# EAGLE design Christmas_Kit (EAGLE 6.4)
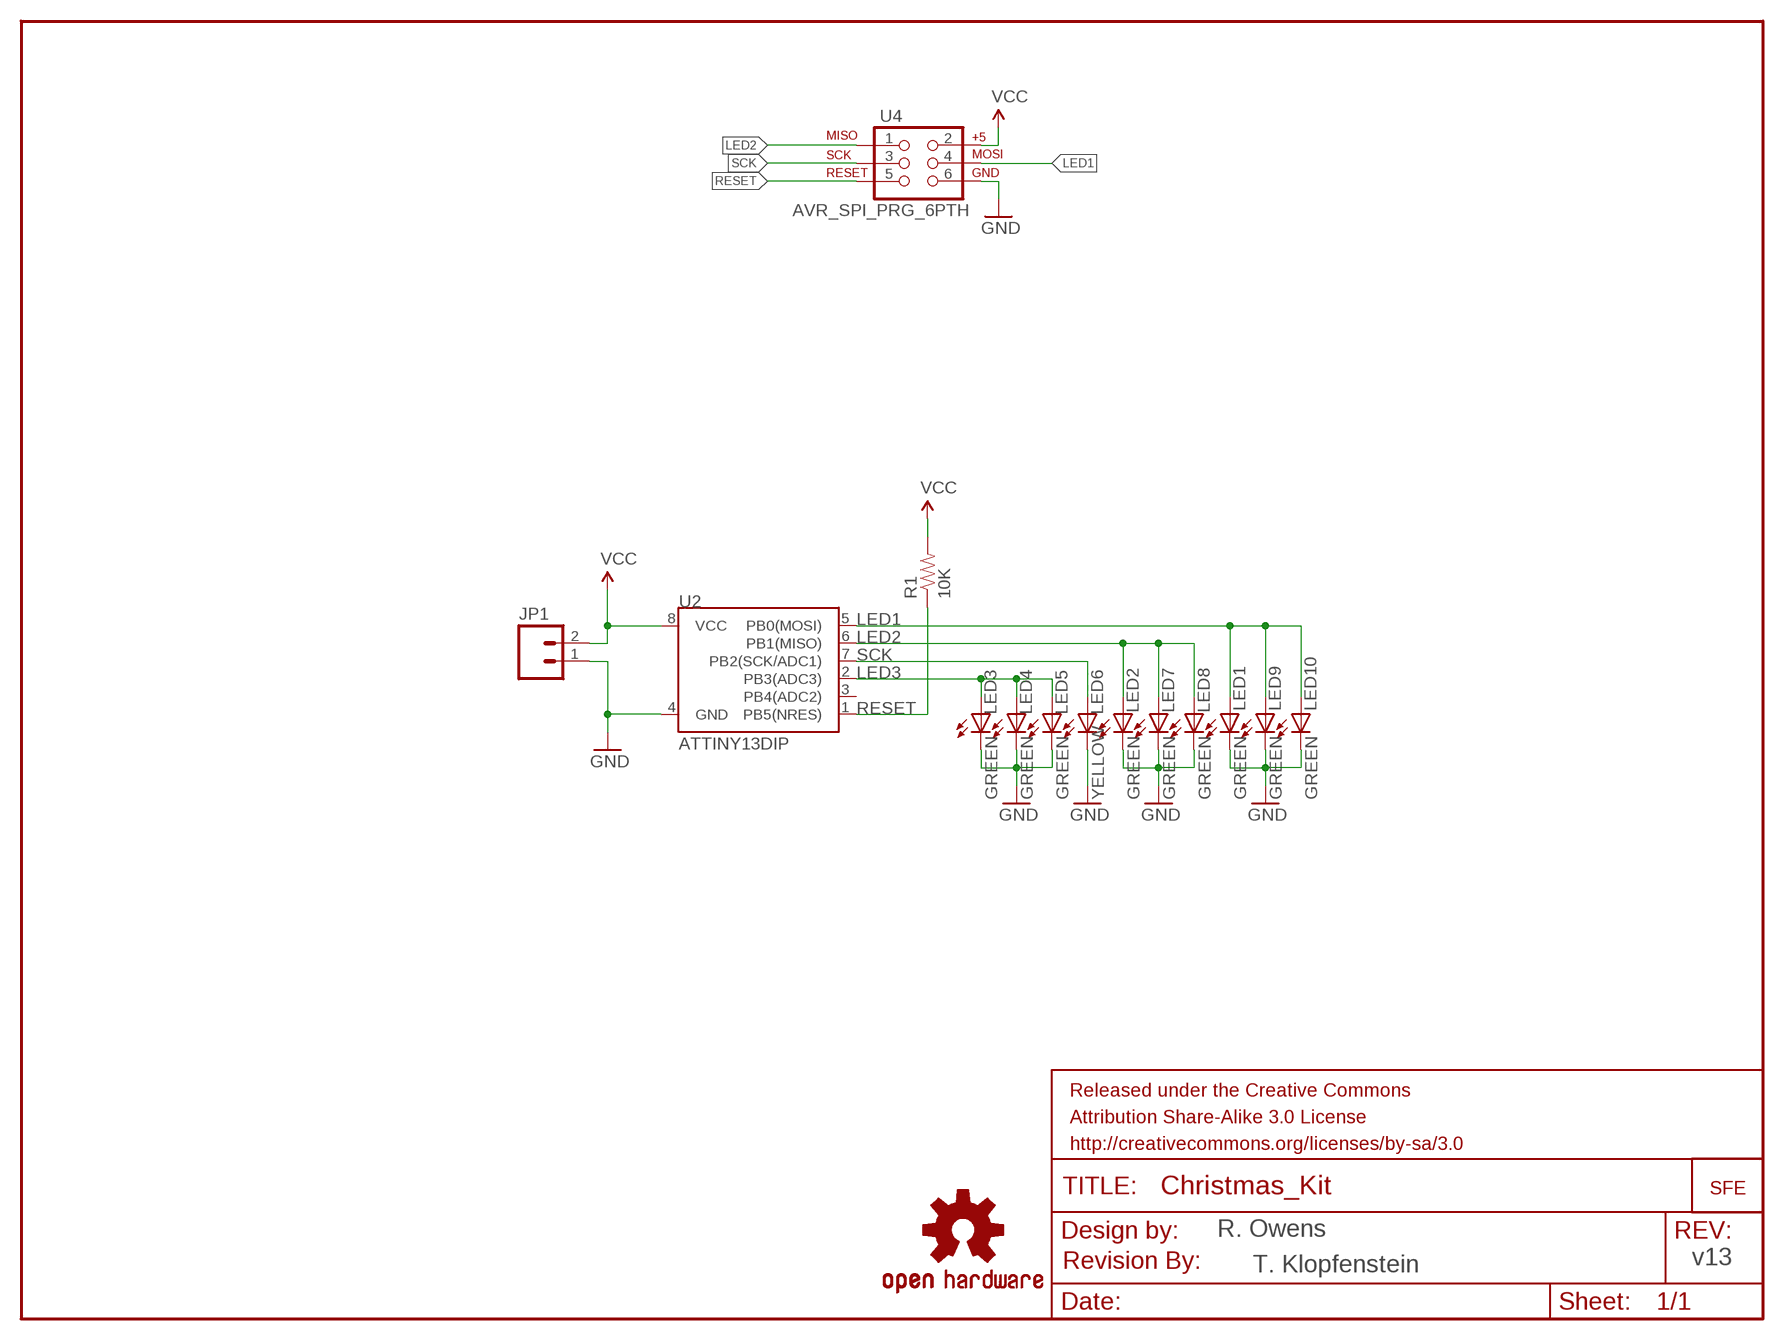
[diagram p0: schematic, sheet 1]

## Parts
FRAME1  FRAME-LETTER  [CREATIVE_COMMONS]
JP1  M02PTH  [1X02]
JP2  LOGO-SFENEW  [SFE-NEW-WEBLOGO]
LED1  GREEN  LED5MM  [LED5MM]
LED2  GREEN  LED5MM  [LED5MM]
LED3  GREEN  LED5MM  [LED5MM]
LED4  GREEN  LED5MM  [LED5MM]
LED5  GREEN  LED5MM  [LED5MM]
LED6  YELLOW  LED3MM  [LED3MM]
LED7  GREEN  LED5MM  [LED5MM]
LED8  GREEN  LED5MM  [LED5MM]
LED9  GREEN  LED5MM  [LED5MM]
LED10  GREEN  LED5MM  [LED5MM]
LOGO1  OSHW-LOGOL  [OSHW-LOGO-L]
R1  10K  RESISTORPTH1  [AXIAL-0.3]
U2  ATTINY13DIP  [DIP08]
U4  AVR_SPI_PRG_6PTH  [2X3]
U$1  REVISION  [REVISION]

## Nets
GND: JP1.1 LED1.K(C) LED2.K(C) LED3.K(C) LED4.K(C) LED5.K(C) LED6.K(C) LED7.K(C) LED8.K(C) LED9.K(C) LED10.K(C) U2.4(GND) U4.6
LED1: LED1.A LED9.A LED10.A U2.5(PB0(MOSI)) U4.4
LED2: LED2.A LED7.A LED8.A U2.6(PB1(MISO)) U4.1
LED3: LED3.A LED4.A LED5.A U2.2(PB3(ADC3))
RESET: R1.P$1 U2.1(PB5(NRES)) U4.5
SCK: LED6.A U2.7(PB2(SCK/ADC1)) U4.3
VCC: JP1.2 R1.P$2 U2.8(VCC) U4.2
Unconnected: U2.3(PB4(ADC2))

## Notes on the sheet
- R. Owens
- v13
- T. Klopfenstein

## Library data of the parts
FRAME1 = SparkFun-Aesthetics:FRAME-LETTER: Schematic Frame Standard 8.5x11 US Letter frame
JP1 = SparkFun:M02: Header 2 Standard 2-pin 0.1" header. Use with straight break away headers (SKU : PRT-00116), right angle break away headers (PRT-00553), swiss pins (PRT-00743), machine pins (PRT-00117), and female headers (PRT-00115). Molex polarized connector foot print use with SKU : PRT-08233 with associated crimp pins and housings.
JP2 = SparkFun:LOGO-SFE: Spark Fun Electronics PCB Logo This is the standard Spark Fun Electronics PCB logo.
LED1-LED10 = SparkFun:LED: LEDs Standard schematic elements and footprints for 5mm, 3mm, 1206, and 0603 sized LEDs. 5mm - Spark Fun Electronics SKU : COM-00529 (and others)
LOGO1 = SparkFun-Aesthetics:OSHW-LOGO: Open Source Hardware Logo This logo indicates the piece of hardware it is found on incorporates a OSHW license and/or adheres to the definition of open source hardware found here: http://freedomdefined.org/OSHW
R1 = SparkFun:RESISTOR: Resistor Basic schematic elements and footprints for 0603, 1206, and PTH 1/10th watt (small) resistors.
U2 = SparkFun:ATTINY13
U4 = SparkFun:AVR_SPI_PRG_6: AVR ISP 6 Pin This is the reduced ISP connector for AVR programming. Common on Arduino. This footprint will take up less PCB space and can be used with a 10-pin to 6-pin adapter such as SKU: BOB-08508
U$1 = SparkFun-Aesthetics:REVISION

## Net classes
0 default: width 0.203 mm

## Board
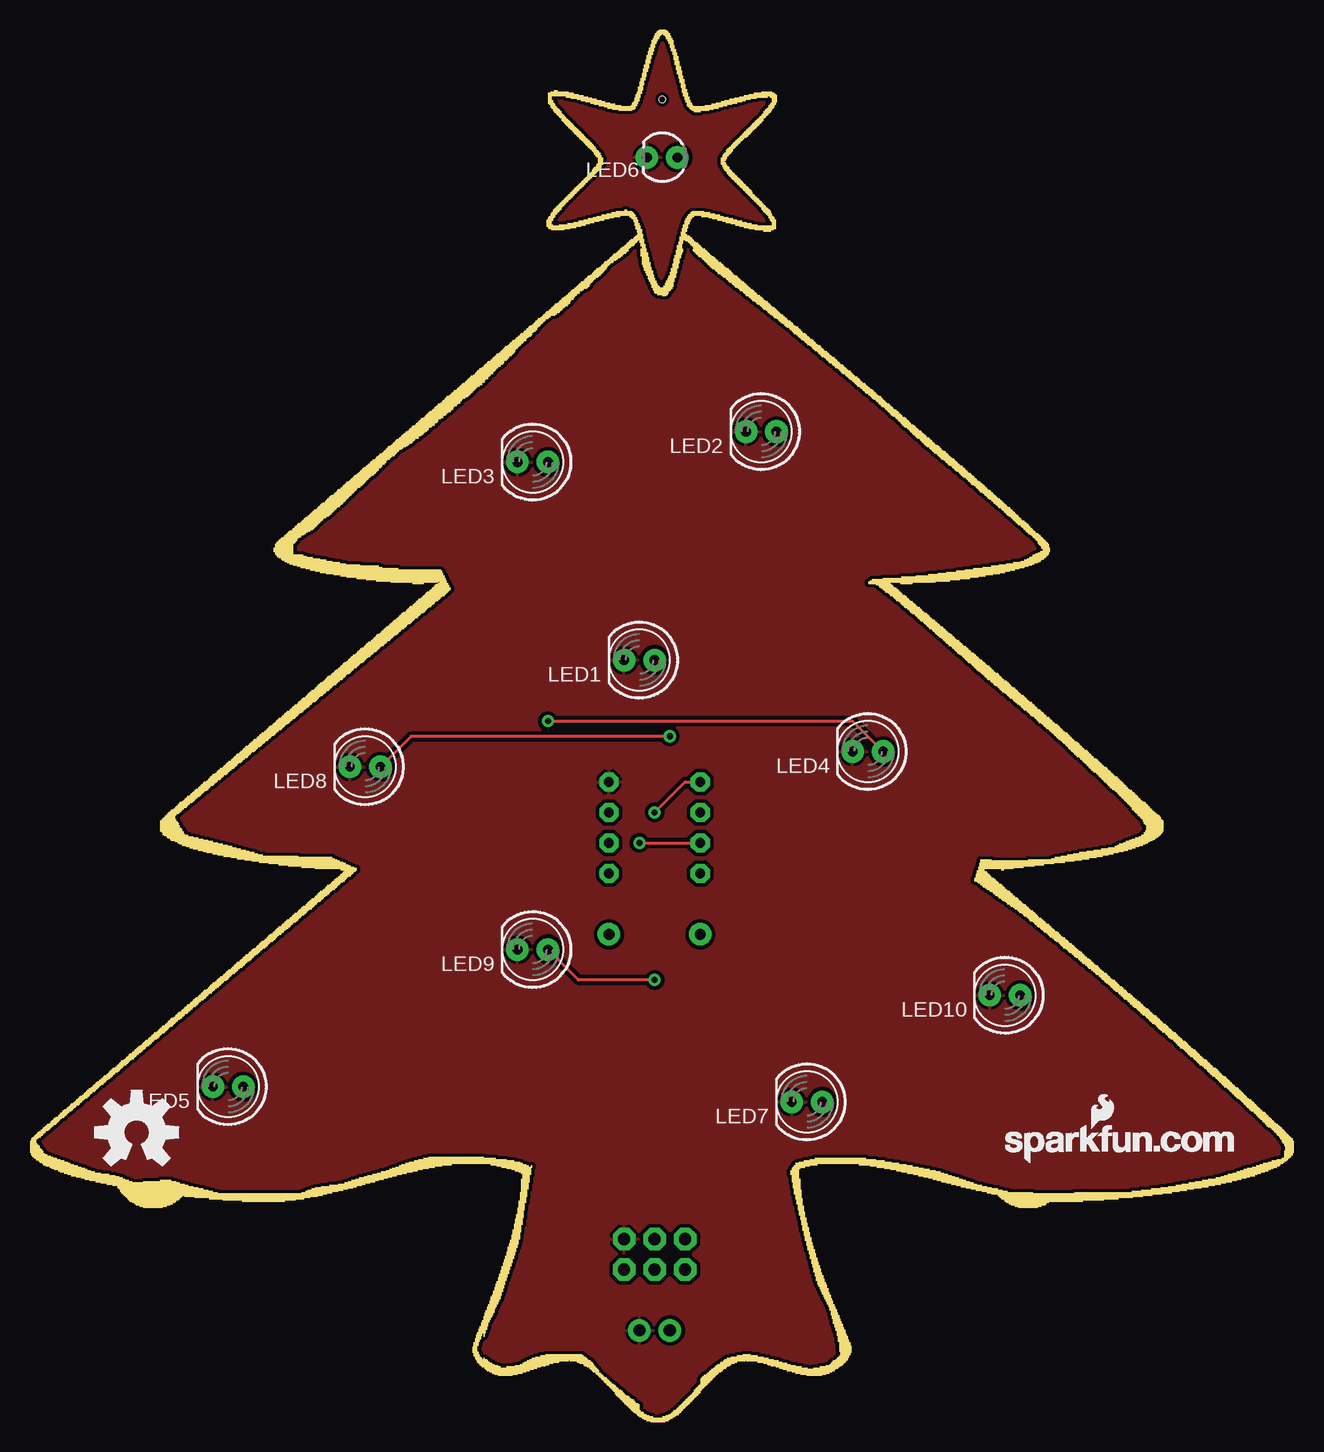
[diagram p1: board, top side]
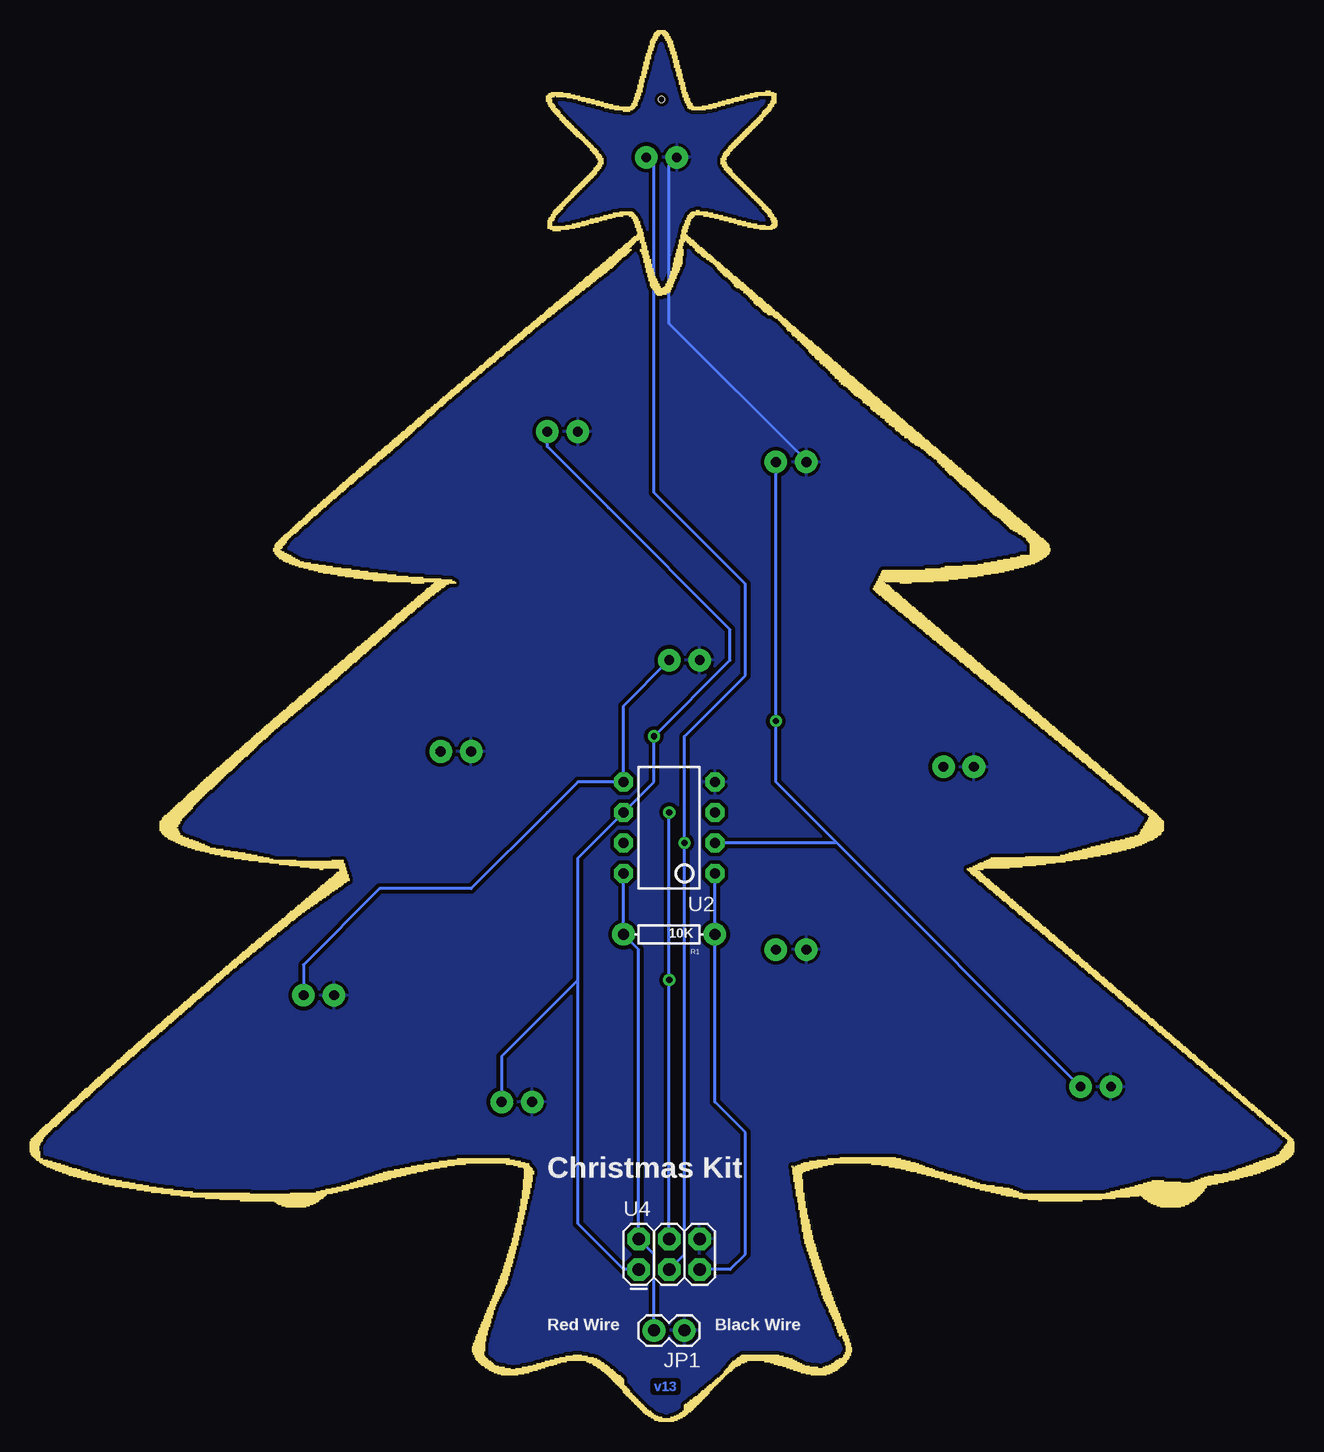
[diagram p2: board, bottom side, seen from below]

Size 105.36 x 116.03 mm. Coordinates in mm from the lower left corner, seen from the top.
Copper layers (1*16): Top 0.035mm / dielectric 1.5mm / Bottom 0.035mm
Design rules "SparkFun *": minimum track width 8mil, minimum drill 20mil, track to track 8mil, track to pad 8mil, pad to pad 8mil, via to via 8mil, smd to smd 8mil, copper to edge 9mil, drill to drill 8mil, minimum pad ring 12mil, minimum via ring 10mil, stop-mask expansion 4mil, vias tented up to drill 20mil, thermal gap 10mil
Holes 0.51 mm at 52.7,110.24

### Footprints (pad centres in the part's own frame; a part is rotated, then mirrored left to right if it is on the bottom)
1X02 = drill 1.016 pad 1.88: 1 0,0; 2 2.54,0
LED5MM = drill 0.813 pad 1.88: A -1.27,0; K 1.27,0
LED3MM = drill 0.813 pad 1.88: A -1.27,0; K 1.27,0
AXIAL-0.3 = drill 0.9 pad 1.88: P$1 -3.81,0; P$2 3.81,0
DIP08 = drill 0.813 pad 1.6 octagon: 1 -3.81,-3.81; 2 -1.27,-3.81; 3 1.27,-3.81; 4 3.81,-3.81; 5 3.81,3.81; 6 1.27,3.81; 7 -1.27,3.81; 8 -3.81,3.81
2X3 = drill 1.016 pad 1.88 octagon: 1 0,0; 2 0,2.54; 3 2.54,0; 4 2.54,2.54; 5 5.08,0; 6 5.08,2.54

### Placement (x,y rotation side)
FRAME1  26.39,-11.43 0 top  (outside the outline)
JP1  50.8,7.62 180 bottom
JP2  81.28,21.59 0 top
LED1  50.8,63.5 180 top
LED2  60.96,82.55 180 top
LED3  41.91,80.01 180 top
LED4  69.85,55.88 180 top
LED5  16.51,27.94 180 top
LED6  52.7,105.41 180 top
LED7  64.77,26.67 180 top
LED8  27.94,54.61 180 top
LED9  41.91,39.37 180 top
LED10  81.28,35.56 180 top
LOGO1  8.89,24.13 0 top
R1  52.07,40.64 180 bottom
U2  52.07,49.53 90 bottom
U4  54.61,12.7 0 bottom
U$1  38.1,-13.97 0 top  (outside the outline)

### Tracks (layer width: path | path; a pad name or v marks a point on that pad's centre or on a via)
GND
  Bottom 0.254: LED6.K 52.07,104.78 52.07,97.28 52.07,91.57 40.64,80.14 LED3.K
  pour Bottom (isolate 0.305): 0,0 105.41,0 105.41,116.84 0,116.84
  pour Top (isolate 0.305): 0,0 105.41,0 105.41,116.84 0,116.84
LED1  (via drill 0.51)
  Top 0.254: U2.5 54.61,53.34 v52.07,50.8 | LED9.A 45.72,36.83 v52.07,36.83
  Bottom 0.254: U4.4 v52.07,36.83 v52.07,50.8 | LED10.A 82.55,38.1 76.2,44.45 68.58,44.45 62.23,50.8 59.69,53.34 U2.5 55.88,59.69 LED1.A
LED2  (via drill 0.51)
  Top 0.254: LED8.A 31.75,57.15 v53.34,57.15
  Bottom 0.254: 59.69,36.83 59.69,16.51 55.88,12.7 U4.1 | 59.69,36.83 59.69,41.91 59.69,46.99 U2.6 53.34,53.34 v53.34,57.15 46.99,63.5 46.99,66.04 57.15,76.2 62.23,81.28 LED2.A | LED7.A 66.04,30.48 59.69,36.83
LED3  (via drill 0.51)
  Top 0.254: LED4.A 68.58,58.42 v43.18,58.42
  Bottom 0.254: LED5.A 38.1,48.26 | 38.1,48.26 U2.2 | LED3.A 43.18,66.04 v43.18,58.42 43.18,53.34 38.1,48.26
RESET
  Bottom 0.254: U4.5 46.99,12.7 45.72,13.97 45.72,24.13 48.26,26.67 R1.P$1 U2.1
SCK  (via drill 0.51)
  Top 0.254: v50.8,48.26 U2.7
  Bottom 0.254: U4.3 50.8,13.97 50.8,45.72 v50.8,48.26 50.8,57.15 45.72,62.23 45.72,69.85 53.34,77.47 53.34,99.06 53.34,104.78 LED6.A
VCC
  Bottom 0.254: JP1.2 53.34,13.97 U4.2 54.61,39.37 R1.P$2 U2.8

### Text on the board
Bottom: v13 | v13
bPlace: Christmas Kit | Black Wire | Red Wire
tNames: R. Owens | T. Klopfenstein